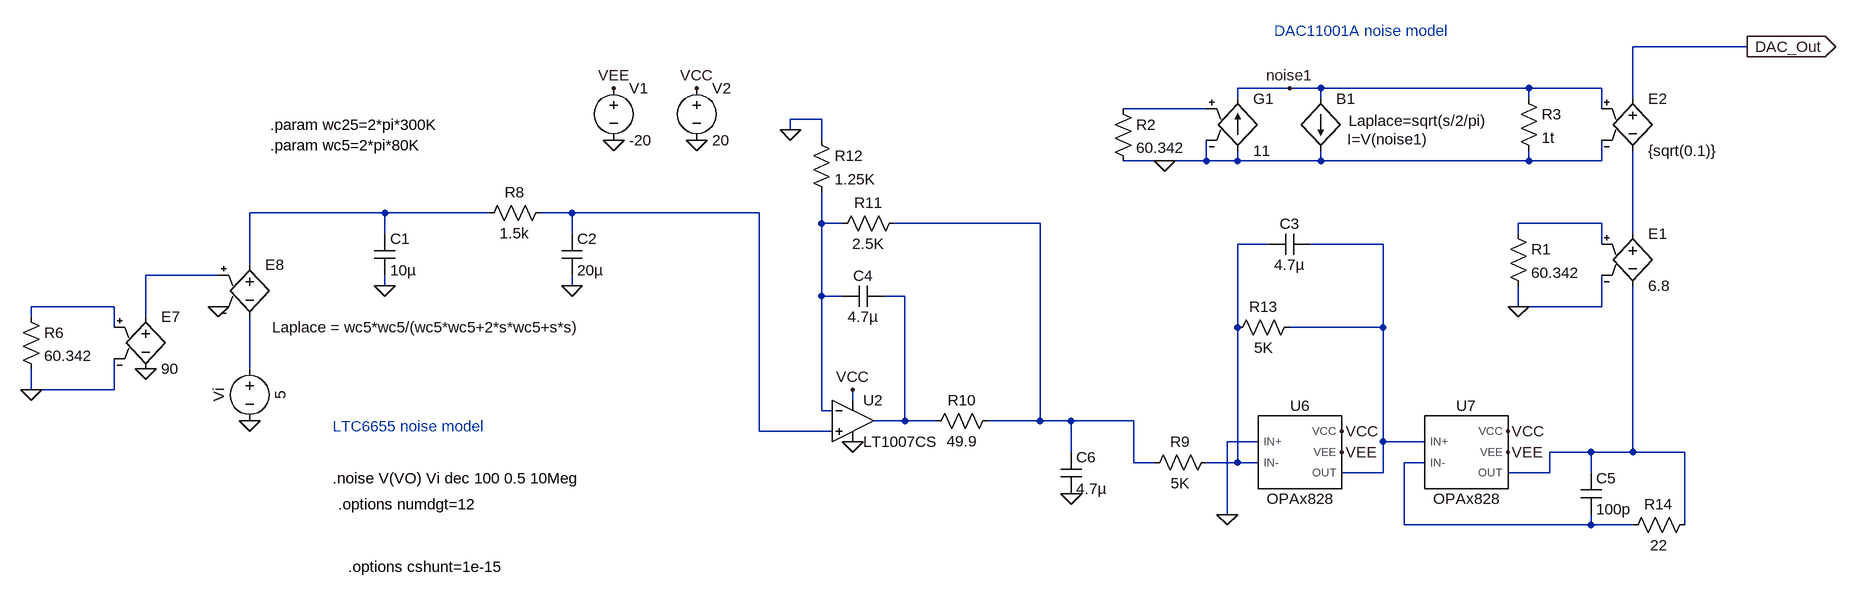
[diagram p0: schematic Trap_Dac_2-1_full_path_DAC11001A.asc]
Trap_Dac_2-1_full_path_DAC11001A.asc, the LTspice schematic file:
Version 4
SHEET 1 4152 1008
WIRE 2416 -1440 2240 -1440
WIRE 1712 -1376 1632 -1376
WIRE 1760 -1376 1712 -1376
WIRE 2080 -1376 1760 -1376
WIRE 2192 -1376 2080 -1376
WIRE 1632 -1360 1632 -1376
WIRE 1760 -1360 1760 -1376
WIRE 2080 -1360 2080 -1376
WIRE 2240 -1360 2240 -1440
WIRE 1584 -1344 1456 -1344
WIRE 2192 -1344 2192 -1376
WIRE 992 -1328 944 -1328
WIRE 944 -1312 944 -1328
WIRE 992 -1296 992 -1328
WIRE 1520 -1264 1456 -1264
WIRE 1584 -1264 1584 -1296
WIRE 1584 -1264 1520 -1264
WIRE 1632 -1264 1632 -1280
WIRE 1632 -1264 1584 -1264
WIRE 1760 -1264 1760 -1280
WIRE 1760 -1264 1632 -1264
WIRE 2080 -1264 2080 -1280
WIRE 2080 -1264 1760 -1264
WIRE 2192 -1264 2192 -1296
WIRE 2192 -1264 2080 -1264
WIRE 320 -1184 112 -1184
WIRE 480 -1184 320 -1184
WIRE 608 -1184 560 -1184
WIRE 896 -1184 608 -1184
WIRE 992 -1168 992 -1216
WIRE 1024 -1168 992 -1168
WIRE 1328 -1168 1104 -1168
WIRE 2192 -1168 2064 -1168
WIRE 320 -1152 320 -1184
WIRE 608 -1152 608 -1184
WIRE 2064 -1152 2064 -1168
WIRE 2240 -1152 2240 -1280
WIRE 1680 -1136 1632 -1136
WIRE 1856 -1136 1744 -1136
WIRE 2192 -1136 2192 -1168
WIRE 112 -1104 112 -1184
WIRE 64 -1088 -48 -1088
WIRE 320 -1072 320 -1088
WIRE 608 -1072 608 -1088
WIRE 992 -1056 992 -1168
WIRE 1024 -1056 992 -1056
WIRE 1120 -1056 1088 -1056
WIRE -96 -1040 -224 -1040
WIRE 2064 -1040 2064 -1072
WIRE 2192 -1040 2192 -1088
WIRE 2192 -1040 2064 -1040
WIRE -224 -1024 -224 -1040
WIRE -48 -1024 -48 -1088
WIRE -96 -1008 -96 -1040
WIRE 1632 -1008 1632 -1136
WIRE 1856 -1008 1856 -1136
WIRE 1856 -1008 1712 -1008
WIRE 112 -944 112 -1024
WIRE -224 -912 -224 -944
WIRE -96 -912 -96 -960
WIRE -96 -912 -224 -912
WIRE 1040 -896 1040 -912
WIRE 992 -880 992 -1056
WIRE 1008 -880 992 -880
WIRE 1120 -864 1120 -1056
WIRE 1120 -864 1072 -864
WIRE 1168 -864 1120 -864
WIRE 1328 -864 1328 -1168
WIRE 1328 -864 1248 -864
WIRE 1376 -864 1328 -864
WIRE 1472 -864 1376 -864
WIRE 896 -848 896 -1184
WIRE 1008 -848 896 -848
WIRE 1664 -832 1616 -832
WIRE 1856 -832 1856 -1008
WIRE 1920 -832 1856 -832
WIRE 1376 -816 1376 -864
WIRE 2176 -816 2112 -816
WIRE 2240 -816 2240 -1072
WIRE 2240 -816 2176 -816
WIRE 2320 -816 2240 -816
WIRE 1472 -800 1472 -864
WIRE 1504 -800 1472 -800
WIRE 1632 -800 1632 -1008
WIRE 1632 -800 1584 -800
WIRE 1664 -800 1632 -800
WIRE 1920 -800 1888 -800
WIRE 1856 -784 1856 -832
WIRE 1856 -784 1792 -784
WIRE 2112 -784 2112 -816
WIRE 2112 -784 2048 -784
WIRE 2176 -784 2176 -816
WIRE 1616 -720 1616 -832
WIRE 1888 -704 1888 -800
WIRE 2176 -704 2176 -720
WIRE 2176 -704 1888 -704
WIRE 2240 -704 2176 -704
WIRE 2320 -704 2320 -816
FLAG -224 -912 0
FLAG -48 -944 0
FLAG 64 -1040 0
FLAG 112 -864 0
FLAG 320 -1072 0
FLAG 608 -1072 0
FLAG 1040 -832 0
FLAG 1376 -752 0
FLAG 1040 -912 VCC
FLAG 944 -1312 0
FLAG 2064 -1040 0
FLAG 1520 -1264 0
FLAG 1712 -1376 noise1
FLAG 800 -1296 0
FLAG 672 -1296 0
FLAG 672 -1376 VEE
FLAG 800 -1376 VCC
FLAG 2048 -848 VCC
FLAG 2048 -816 VEE
FLAG 1792 -816 VEE
FLAG 1792 -848 VCC
FLAG 1616 -720 0
FLAG 2416 -1440 DAC_Out
IOPIN 2416 -1440 Out
SYMBOL res -240 -1040 R0
SYMATTR InstName R6
SYMATTR Value 60.342
SYMBOL e -48 -1040 R0
SYMATTR InstName E7
SYMATTR Value 90
SYMBOL e 112 -1120 R0
WINDOW 3 35 112 Left 2
SYMATTR Value Laplace = wc5*wc5/(wc5*wc5+2*s*wc5+s*s)
SYMATTR InstName E8
SYMBOL voltage 112 -960 R0
WINDOW 0 -32 56 VBottom 2
WINDOW 3 32 56 VTop 2
WINDOW 123 0 0 Left 0
WINDOW 39 0 0 Left 0
SYMATTR InstName Vi
SYMATTR Value 5
SYMBOL res 576 -1200 R90
WINDOW 0 0 56 VBottom 2
WINDOW 3 32 56 VTop 2
SYMATTR InstName R8
SYMATTR Value 1.5k
SYMBOL cap 304 -1152 R0
SYMATTR InstName C1
SYMATTR Value 10µ
SYMBOL cap 592 -1152 R0
SYMATTR InstName C2
SYMATTR Value 20µ
SYMBOL res 1264 -880 R90
WINDOW 0 0 56 VBottom 2
WINDOW 3 32 56 VTop 2
SYMATTR InstName R10
SYMATTR Value 49.9
SYMBOL cap 1088 -1072 R90
WINDOW 0 0 32 VBottom 2
WINDOW 3 32 32 VTop 2
SYMATTR InstName C4
SYMATTR Value 4.7µ
SYMBOL res 1120 -1184 R90
WINDOW 0 0 56 VBottom 2
WINDOW 3 32 56 VTop 2
SYMATTR InstName R11
SYMATTR Value 2.5K
SYMBOL cap 1360 -816 R0
SYMATTR InstName C6
SYMATTR Value 4.7µ
SYMBOL Opamps\\LT1007CS 1040 -928 R0
SYMATTR InstName U2
SYMBOL res 976 -1312 R0
SYMATTR InstName R12
SYMATTR Value 1.25K
SYMBOL res 2048 -1168 R0
SYMATTR InstName R1
SYMATTR Value 60.342
SYMBOL e 2240 -1168 R0
SYMATTR InstName E1
SYMATTR Value 6.8
SYMBOL g 1632 -1376 R0
SYMATTR InstName G1
SYMATTR Value 11
SYMBOL res 1440 -1360 R0
SYMATTR InstName R2
SYMATTR Value 60.342
SYMBOL bi 1760 -1360 R0
WINDOW 3 41 63 Left 2
WINDOW 123 43 34 Left 2
SYMATTR Value I=V(noise1)
SYMATTR Value2 Laplace=sqrt(s/2/pi)
SYMATTR InstName B1
SYMBOL e 2240 -1376 R0
SYMATTR InstName E2
SYMATTR Value {sqrt(0.1)}
SYMBOL res 2064 -1376 R0
SYMATTR InstName R3
SYMATTR Value 1t
SYMBOL voltage 672 -1392 R0
WINDOW 123 0 0 Left 0
WINDOW 39 0 0 Left 0
SYMATTR InstName V1
SYMATTR Value -20
SYMBOL voltage 800 -1392 R0
WINDOW 123 0 0 Left 0
WINDOW 39 0 0 Left 0
SYMATTR InstName V2
SYMATTR Value 20
SYMBOL res 1600 -816 R90
WINDOW 0 0 56 VBottom 2
WINDOW 3 32 56 VTop 2
SYMATTR InstName R9
SYMATTR Value 5K
SYMBOL res 1728 -1024 R90
WINDOW 0 0 56 VBottom 2
WINDOW 3 32 56 VTop 2
SYMATTR InstName R13
SYMATTR Value 5K
SYMBOL cap 1744 -1152 R90
WINDOW 0 0 32 VBottom 2
WINDOW 3 32 32 VTop 2
SYMATTR InstName C3
SYMATTR Value 4.7µ
SYMBOL res 2336 -720 R90
WINDOW 0 0 56 VBottom 2
WINDOW 3 32 56 VTop 2
SYMATTR InstName R14
SYMATTR Value 22
SYMBOL cap 2160 -784 R0
SYMATTR InstName C5
SYMATTR Value 100p
SYMBOL OPAx828 1728 -816 R0
SYMATTR InstName U6
SYMBOL OPAx828 1984 -816 R0
SYMATTR InstName U7
TEXT 240 -776 Left 2 !.noise V(VO) Vi dec 100 0.5 10Meg
TEXT 144 -1288 Left 2 !.param wc5=2*pi*80K
TEXT 144 -1320 Left 2 !.param wc25=2*pi*300K
TEXT 240 -856 Left 2 ;LTC6655 noise model
TEXT 1688 -1464 Left 2 ;DAC11001A noise model
TEXT 248 -736 Left 2 !.options numdgt=12
TEXT 264 -640 Left 2 !.options cshunt=1e-15

The netlist it stands for:
* Trap_Dac_2-1_full_path_DAC11001A.asc
R6 N012 0 60.342
E7 N010 0 N012 0 90
E8 N002 N013 N010 0 Laplace = wc5*wc5/(wc5*wc5+2*s*wc5+s*s)
Vi N013 0 5
R8 N003 N002 1.5k
C1 N002 0 10µ
C2 N003 0 20µ
R10 N005 N011 49.9
C4 N011 N004 4.7µ
R11 N005 N004 2.5K
C6 N005 0 4.7µ
XU2 N003 N004 VCC 0 N011 LT1007CS  ; pins In+ In- V+ V- OUT
R12 0 N004 1.25K
R1 N006 0 60.342
E1 N007 N014 N006 0 6.8
G1 0 noise1 N001 0 11
R2 N001 0 60.342
B1 noise1 0 I=V(noise1) Laplace=sqrt(s/2/pi)
E2 DAC_Out N007 noise1 0 {sqrt(0.1)}
R3 noise1 0 1t
V1 VEE 0 -20
V2 VCC 0 20
R9 N008 N005 5K
R13 N009 N008 5K
C3 N009 N008 4.7µ
R14 N014 N015 22
C5 N014 N015 100p
XU6 0 N008 VCC VEE N009 OPAx828  ; pins IN+ IN- VCC VEE OUT
XU7 N009 N015 VCC VEE N014 OPAx828  ; pins IN+ IN- VCC VEE OUT
.noise V(VO) Vi dec 100 0.5 10Meg
.param wc5=2*pi*80K
.param wc25=2*pi*300K
* LTC6655 noise model
* DAC11001A noise model
.options numdgt=12
.options cshunt=1e-15
.lib ..\Lib\OPAx828.LIB
.backanno
.end